# Altium schematic sheet DC075B_HARDWARE.SchDoc: HARDWARE
size 558 x 431 mm; Date: Not shown in title block; ApprovedBy: Not shown in title block; CheckedBy: Not shown in title block; Author: Not shown in title block; CompanyName: Not shown in title block; DrawnBy: Praveen Aroul; Engineer: Not shown in title block; Organization: Not shown in title block; Address1: Not shown in title block; Address2: Not shown in title block; Address3: Not shown in title block; Address4: Not shown in title block; DocumentNumber: 13; Revision: Use project parameter SCH_Rev; SheetNumber: 13; SheetTotal: 13; PageSetup: Record=PageOptions|CenterHorizontal=True|CenterVertical=True|PrintScale=1.00|XCorrection=1.00|YCorrection=1.00|PrintKind=0|BorderSize=5000000|LeftOffset=0|BottomOffset=0|Orientation=2|PaperLength=1000|PaperWidth=1000|Scale=100|PaperSource=15|PrintQuality=600|MediaType=1|DitherType=10|PaperKind=Letter|PrintScaleMode=1; CurrentTime: Not shown in title block; CurrentDate: Not shown in title block; Time: Not shown in title block; DocumentFullPathAndName: Not shown in title block; DocumentName: Not shown in title block; ModifiedDate: Not shown in title block; ImagePath: Not shown in title block
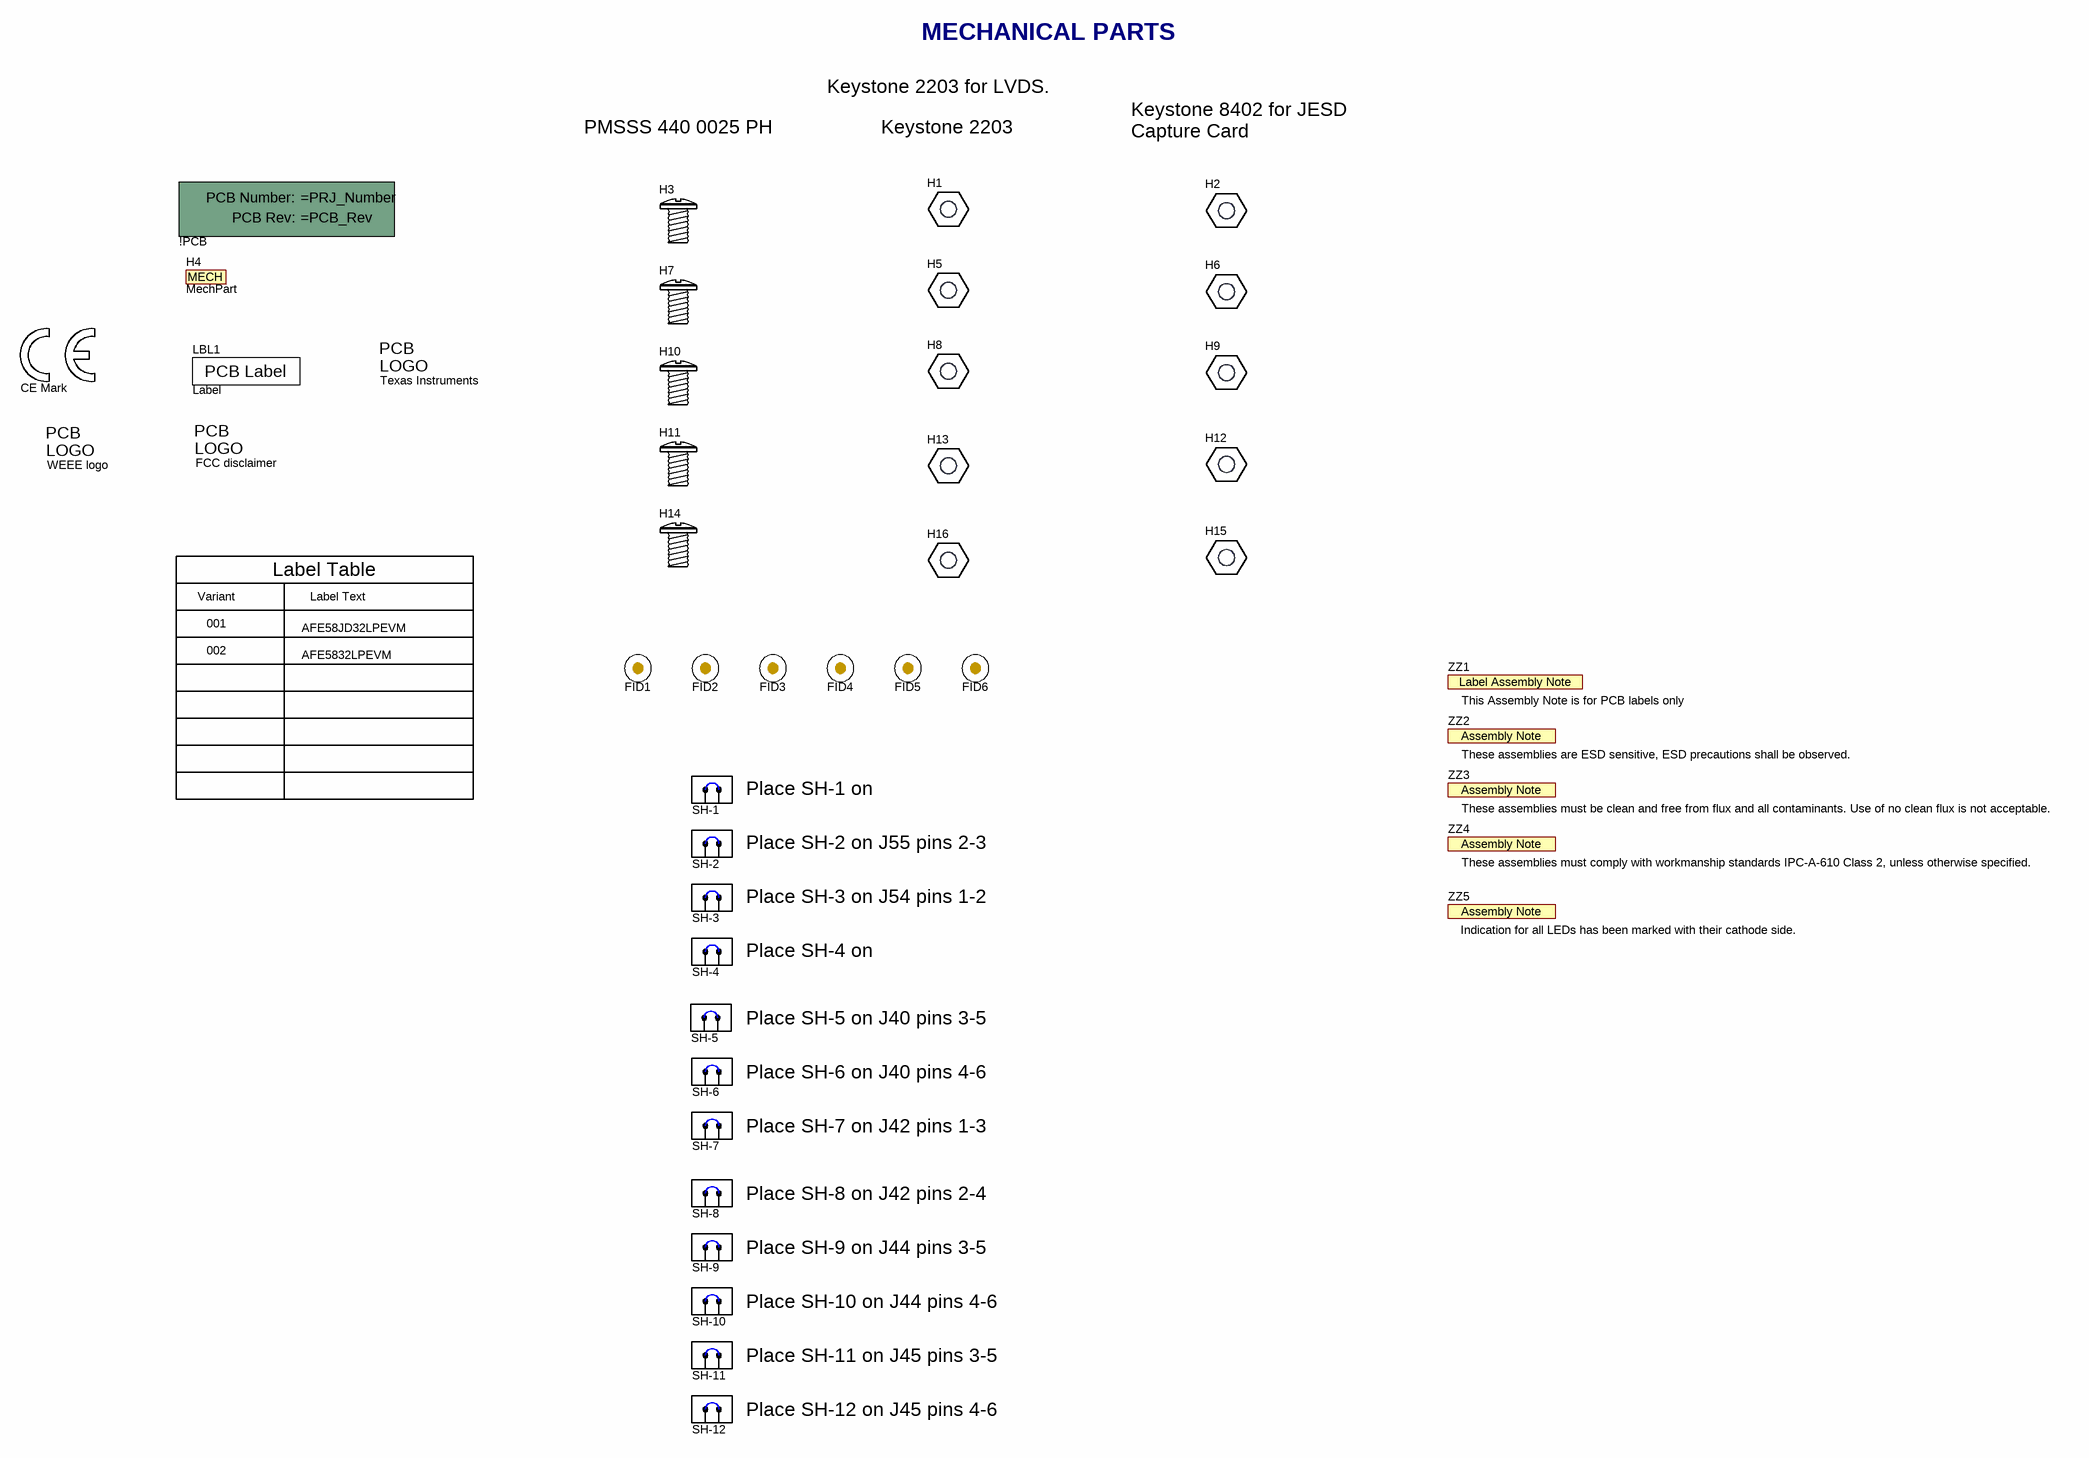
[diagram p0: DC075B_HARDWARE.SchDoc]

## Parts
!PCB  Printed Circuit Board  (value not drawn)  (mechanical)
FID1  Fiducial  [Fiducial10-20]  (value not drawn)
FID2  Fiducial  [Fiducial10-20]  (value not drawn)
FID3  Fiducial  [Fiducial10-20]  (value not drawn)
FID4  Fiducial  [Fiducial10-20]  (value not drawn)
FID5  Fiducial  [Fiducial10-20]  (value not drawn)
FID6  Fiducial  [Fiducial10-20]  (value not drawn)
H1  Nut  [Keystone_2203]  (value not drawn)
H2  Nut  [Keystone_8402]  (value not drawn)
H3  SCREW  [B_F_PMSSS4400025PH]  (value not drawn)
H4  MechPart  (mechanical)
H5  Nut  [Keystone_2203]  (value not drawn)
H6  Nut  [Keystone_8402]  (value not drawn)
H7  SCREW  [B_F_PMSSS4400025PH]  (value not drawn)
H8  Nut  [Keystone_2203]  (value not drawn)
H9  Nut  [Keystone_8402]  (value not drawn)
H10  SCREW  [B_F_PMSSS4400025PH]  (value not drawn)
H11  SCREW  [B_F_PMSSS4400025PH]  (value not drawn)
H12  Nut  [Keystone_8402]  (value not drawn)
H13  Nut  [Keystone_2203]  (value not drawn)
H14  SCREW  [B_F_PMSSS4400025PH]  (value not drawn)
H15  Nut  [Keystone_8402]  (value not drawn)
H16  Nut  [Keystone_2203]  (value not drawn)
LBL1  Label  [Label_650x200]
Logo1  CE Mark  [CE_Mark_5mm]  (no BOM)
Logo2  FCC disclaimer  [FCC_disclaimer_stacked]  (no BOM)
Logo4  WEEE logo  [WEEE_Minimum]  (no BOM)
Logo5  Texas Instruments  [TI_Stacked_Overlay_Small]  (no BOM)
SH-1  SNT-100-BK-G  [SNT-100-BK-G]  (value not drawn)
SH-2  SNT-100-BK-G  [SNT-100-BK-G]  (value not drawn)
SH-3  SNT-100-BK-G  [SNT-100-BK-G]  (value not drawn)
SH-4  SNT-100-BK-G  [SNT-100-BK-G]  (value not drawn)
SH-5  Shunt  [SNT-100-BK-G]  (value not drawn)
SH-6  Shunt  [SNT-100-BK-G]  (value not drawn)
SH-7  Shunt  [SNT-100-BK-G]  (value not drawn)
SH-8  Shunt  [SNT-100-BK-G]  (value not drawn)
SH-9  Shunt  [SNT-100-BK-G]  (value not drawn)
SH-10  Shunt  [SNT-100-BK-G]  (value not drawn)
SH-11  Shunt  [SNT-100-BK-G]  (value not drawn)
SH-12  Shunt  [SNT-100-BK-G]  (value not drawn)
ZZ1  This Assembly Note is for PCB labels only  [AssemblyNoteLabel]  (no BOM)
ZZ2  These assemblies are ESD sensitive, ESD precautions shall be observed.  [AssemblyNote]  (no BOM)
ZZ3  These assemblies must be clean and free from flux and all contaminants. Use of no clean flux is not acceptable.  [AssemblyNote]  (no BOM)
ZZ4  These assemblies must comply with workmanship standards IPC-A-610 Class 2, unless otherwise specified.  [AssemblyNote]  (no BOM)
ZZ5  Indication for all LEDs has been marked with their cathode side.  [AssemblyNote]  (no BOM)

## Notes on the sheet
- MECHANICAL PARTS
- Keystone 2203 for LVDS.
- PMSSS 440 0025 PH
- Keystone 2203
- Keystone 8402 for JESD Capture Card
- Label Table
- Variant
- 001
- 002
- Label Text
- AFE5832LPEVM
- AFE58JD32LPEVM
- (near SH-1) Place SH-1 on J53
- (near SH-2) Place SH-2 on J55 pins 2-3
- (near SH-3) Place SH-3 on J54 pins 1-2
- (near SH-4) Place SH-4 on J57
- (near SH-5) Place SH-5 on J40 pins 3-5
- (near SH-6) Place SH-6 on J40 pins 4-6
- (near SH-7) Place SH-7 on J42 pins 1-3
- (near SH-8) Place SH-8 on J42 pins 2-4
- (near SH-9) Place SH-9 on J44 pins 3-5
- (near SH-10) Place SH-10 on J44 pins 4-6
- (near SH-11) Place SH-11 on J45 pins 3-5
- (near SH-12) Place SH-12 on J45 pins 4-6
- Drawn By:
- SVN Rev:
- Number:
- TID #:
- Orderable:
- Rev:
- Sheet Title:
- File:
- Project Title:
- Designed for:
- Assembly Variant:
- Mod. Date:
- Sheet:
- Size:
- of
- C
- http://www.ti.com
- Texas Instruments and/or its licensors do not warrant the accuracy or completeness of this specification or any information contained therein. Texas Instruments and/or its licensors do not warrant that this design will meet the specifications, will be suitable for your application or fit for any particular purpose, or will operate in an implementation. Texas Instruments and/or its licensors do not warrant that the design is production worthy. You should completely validate and test your design implementation to confirm the system functionality for your application.
- Engineer:
- Contact:
- © Texas Instruments
- (in symbol CMP-0003615-1) Assembly Note
- (in symbol CMP-0003616-3) Label Assembly Note
- (in symbol CMP-0003618-2) PCB Number:; PCB Rev:
- (in symbol CMP-0003625-1) PCB Label
- (in symbol CMP-0003778-1) MECH
- (in symbol CMP-0074769-1) PCB; LOGO
- (in symbol CMP-0074838-1) PCB; LOGO
- (in symbol CMP-0074847-1) PCB; LOGO

## Library data of the parts
!PCB = CMP-0003618-2: Manufacturer: Any; CompType: PCB; PartNumber: =PRJ_Number; RoHS: O; MountType: N/A; Publisher: Texas Instruments; LatestRevisionDate: 2017-03-09; Key: PCB
FID1-FID6 = CMP-0077181-1: Fiducial mark.  There is nothing to buy or mount.; CompType: Fiducial; Manufacturer: N/A; MountType: N/A; PackageReference: N/A; PartNumber: N/A; ClassName: FiducialMark; Library Reference: Fiducial
H1 H5 H8 H13 H16 = CMP-0003779-1: HEX STANDOFF 4-40 ALUMINUM 1/2"; Manufacturer: Keystone; PartNumber: 2203; CompType: Standoff; RoHS: Y; PackageReference: HEX STANDOFF 4-40 ALUMINUM 1/2 inch; MountType: N/A; ComponentLink1Description: Datasheet Link; ComponentLink1URL: http://www.keyelco.com/product-pdf.cfm?p=4279; Publisher: Texas Instruments; LatestRevisionDate: 2017-03-09; Supplier 1: Digi-Key; Supplier Part Number 1: 36-2203-ND; Supplier 2: Newark; Supplier Part Number 2: 89F1952; Supplier 3: Mouser; Supplier Part Number 3: 534-2203; Key: 2203
H2 H6 H9 H12 H15 = CMP-0003797-1: HEX, M-F STANDOFF 4-40 ALUMINUM 1/2"; Manufacturer: Keystone; PartNumber: 8402; CompType: Standoff; RoHS: Y; PackageReference: HEX, M-F STANDOFF 4-40 ALUMINUM 1/2 inch; MountType: N/A; ComponentLink1Description: Datasheet Link; ComponentLink1URL: http://www.keyelco.com/product-pdf.cfm?p=4921; Publisher: Texas Instruments; LatestRevisionDate: 2017-03-09; Supplier 1: Digi-Key; Supplier Part Number 1: 36-8402-ND; Supplier 2: Newark; Supplier Part Number 2: 02M0659; Supplier 3: Mouser; Supplier Part Number 3: 534-8402; Key: 8402
H3 H7 H10 H11 H14 = CMP-0003715-1: MACHINE SCREW PAN PHILLIPS 4-40; Manufacturer: B&F Fastener Supply; PartNumber: PMSSS 440 0025 PH; CompType: Standoff; RoHS: Y; PackageReference: Machine Screw, 4-40, 1/4 inch; MountType: TH; ComponentLink1Description: Datasheet Link; ComponentLink1URL: http://www.fasnetdirect.com/refguide/Machinepancombo.pdf; Publisher: Texas Instruments; LatestRevisionDate: 2017-03-09; Supplier 1: Digi-Key; Supplier Part Number 1: H703-ND; Key: PMSSS 440 0025 PH
H4 = CMP-0003778-1: CABLE ASSY STR 2.1MM 6' 24 AWG - Kitting item; Manufacturer: Tensility; PartNumber: CA-2185; CompType: Cable; RoHS: Y; MountType: N/A; ComponentLink1Description: Datasheet Link; ComponentLink1URL: http://www.tensility.com/pdffiles/053-0184R.pdf; Publisher: Texas Instruments; LatestRevisionDate: 2017-03-09; Supplier 1: Digi-Key; Supplier Part Number 1: CP-2185-ND; Key: CA-2185
LBL1 = CMP-0003625-1: Thermal Transfer Printable Labels, 0.650" W x 0.200" H - 10,000 per roll; Manufacturer: Brady; PartNumber: THT-14-423-10; Note: Size: 0.65" x 0.20 "; ClassName: Label; CompType: Label; RoHS: Y; PackageReference: PCB Label 0.650 x 0.200 inch; MountType: N/A; ComponentLink1Description: Web Page; ComponentLink1URL: http://www.bradyid.com/bradyid/pdpv/THT-14-423-10.html; Publisher: Texas Instruments; LatestRevisionDate: 2017-03-09; Supplier 1: Newark; Supplier Part Number 1: 97C5133; Supplier 2: Farnell; Supplier Part Number 2: 2065596; Key: THT-14-423-10
Logo1 = CMP-0074844-1: SymbolCreator: a0412235; Published: 2009-03-03; Publisher: Texas Instruments; LatestRevisionDate: 2017-07-06; Lib Reference: CE Mark; PartNumber: CE Mark; Library Reference: CE Mark
Logo2 = CMP-0074847-1: FCC_disclaimer; Published: 2009-03-03; Publisher: Texas Instruments; LatestRevisionDate: 2017-07-06; Lib Reference: FCC_disclaimer; PartNumber: FCC disclaimer; Library Reference: Logo
Logo4 = CMP-0074769-1: Library Reference: WEEE logo; Lib Reference: WEEE logo; PartNumber: WEEE logo
Logo5 = CMP-0074838-1: Texas Instrument Corporate Signature; SymbolCreator: a0412235; Lib Reference: TI_Logo; SymbolVersion: 2011-08-22; Published: 2009-03-03; Publisher: Texas Instruments; ClassName: Logo; LatestRevisionDate: 2017-07-06; PartNumber: Texas Instruments; Library Reference: Logo
SH-1-SH-12 = CMP-0003623-3: Shunt, 100mil, Gold plated, Black; Manufacturer: Samtec; Alternate Manufacturer: 3M; Alternate PartNumber: 969102-0000-DA; Value: 1x2; Note: You can "mate" this to a header by matching the designator.  i.e. use SH-J3 for header J3; ClassName: Shunt; CompType: Shunt; PartNumber: SNT-100-BK-G; RoHS: Y; PackageReference: Shunt; MountType: N/A; ComponentLink1Description: Datasheet Link; ComponentLink1URL: http://www.samtec.com/ftppub/pdf/SNT.PDF; Supplier 1: Digi-Key; Supplier Part Number 1: SAM8858-ND
ZZ1 = CMP-0003616-3: CompType: AssemblyNote; ClassName: AssemblyNote; Publisher: Texas Instruments; LatestRevisionDate: 2017-03-09; Key: AssemblyNoteLabel
ZZ2 = CMP-0077236-1: CompType: AssemblyNote; ClassName: AssemblyNote; Publisher: Texas Instruments; LatestRevisionDate: 2017-08-10; Key: AssemblyNote
ZZ3 = CMP-0077237-1: CompType: AssemblyNote; ClassName: AssemblyNote; Publisher: Texas Instruments; LatestRevisionDate: 2017-08-10; Key: AssemblyNote
ZZ4 = CMP-0077238-1: CompType: AssemblyNote; ClassName: AssemblyNote; Publisher: Texas Instruments; LatestRevisionDate: 2017-08-10; Key: AssemblyNote
ZZ5 = CMP-0003615-1: This Assembly Note will show in the PcbDoc and associated outputs; Key: AssemblyNote; Publisher: Texas Instruments; CompType: AssemblyNote; LatestRevisionDate: 2017-03-09; ClassName: AssemblyNote